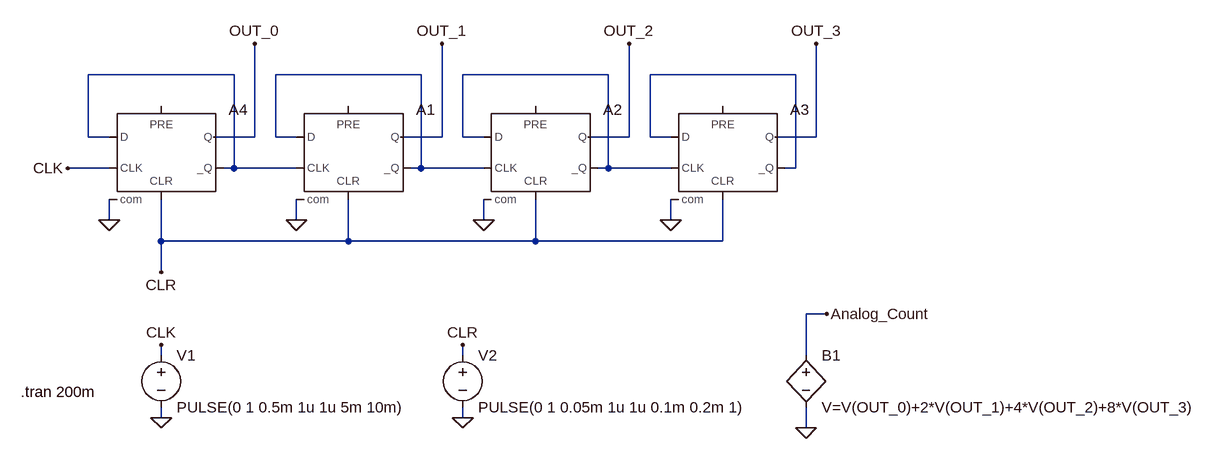
[diagram p0: schematic Fig_9-13_4-Bit-Coun_Analog.asc]
Fig_9-13_4-Bit-Coun_Analog.asc, the LTspice schematic file:
Version 4
SHEET 1 1636 680
WIRE -64 48 -288 48
WIRE 224 48 0 48
WIRE 512 48 288 48
WIRE 800 48 576 48
WIRE -288 144 -288 48
WIRE -256 144 -288 144
WIRE -32 144 -32 0
WIRE -32 144 -96 144
WIRE 0 144 0 48
WIRE 32 144 0 144
WIRE 256 144 256 0
WIRE 256 144 192 144
WIRE 288 144 288 48
WIRE 320 144 288 144
WIRE 544 144 544 0
WIRE 544 144 480 144
WIRE 576 144 576 48
WIRE 608 144 576 144
WIRE 832 144 832 0
WIRE 832 144 768 144
WIRE -256 192 -320 192
WIRE -64 192 -64 48
WIRE -64 192 -80 192
WIRE 32 192 -64 192
WIRE 224 192 224 48
WIRE 224 192 208 192
WIRE 320 192 224 192
WIRE 512 192 512 48
WIRE 512 192 496 192
WIRE 608 192 512 192
WIRE 800 192 800 48
WIRE 800 192 784 192
WIRE -256 272 -256 240
WIRE 32 272 32 240
WIRE 320 272 320 240
WIRE 608 272 608 240
WIRE -176 304 -176 240
WIRE 112 304 112 240
WIRE 112 304 -176 304
WIRE 400 304 400 240
WIRE 400 304 112 304
WIRE 688 304 688 240
WIRE 688 304 400 304
WIRE -176 352 -176 304
WIRE 848 416 816 416
WIRE -176 480 -176 464
WIRE 288 480 288 464
WIRE 816 480 816 416
WIRE -176 576 -176 560
WIRE 288 576 288 560
WIRE 816 592 816 560
FLAG -256 272 0
FLAG 32 272 0
FLAG 320 272 0
FLAG 608 272 0
FLAG -176 352 CLR
FLAG -176 576 0
FLAG 288 576 0
FLAG -176 464 CLK
FLAG 288 464 CLR
FLAG -32 0 OUT_0
FLAG 256 0 OUT_1
FLAG 544 0 OUT_2
FLAG 832 0 OUT_3
FLAG -320 192 CLK
FLAG 816 592 0
FLAG 848 416 Analog_Count
SYMBOL Digital\\dflop 112 96 R0
SYMATTR InstName A1
SYMBOL Digital\\dflop 400 96 R0
SYMATTR InstName A2
SYMBOL Digital\\dflop 688 96 R0
SYMATTR InstName A3
SYMBOL Digital\\dflop -176 96 R0
SYMATTR InstName A4
SYMBOL voltage -176 464 R0
WINDOW 123 0 0 Left 2
WINDOW 39 0 0 Left 2
SYMATTR InstName V1
SYMATTR Value PULSE(0 1 0.5m 1u 1u 5m 10m)
SYMBOL voltage 288 464 R0
WINDOW 123 0 0 Left 2
WINDOW 39 0 0 Left 2
SYMATTR InstName V2
SYMATTR Value PULSE(0 1 0.05m 1u 1u 0.1m 0.2m 1)
SYMBOL bv 816 464 R0
SYMATTR InstName B1
SYMATTR Value V=V(OUT_0)+2*V(OUT_1)+4*V(OUT_2)+8*V(OUT_3)
TEXT -392 536 Left 2 !.tran 200m

The netlist it stands for:
* Fig_9-13_4-Bit-Coun_Analog.asc
A1 N002 0 N001 0 CLR N002 OUT_1 0 DFLOP
A2 N003 0 N002 0 CLR N003 OUT_2 0 DFLOP
A3 N004 0 N003 0 CLR N004 OUT_3 0 DFLOP
A4 N001 0 CLK 0 CLR N001 OUT_0 0 DFLOP
V1 CLK 0 PULSE(0 1 0.5m 1u 1u 5m 10m)
V2 CLR 0 PULSE(0 1 0.05m 1u 1u 0.1m 0.2m 1)
B1 Analog_Count 0 V=V(OUT_0)+2*V(OUT_1)+4*V(OUT_2)+8*V(OUT_3)
.tran 200m
.backanno
.end